# EAGLE design TinyIRCam-breakout-mk-1.0 (EAGLE 7.5.0)
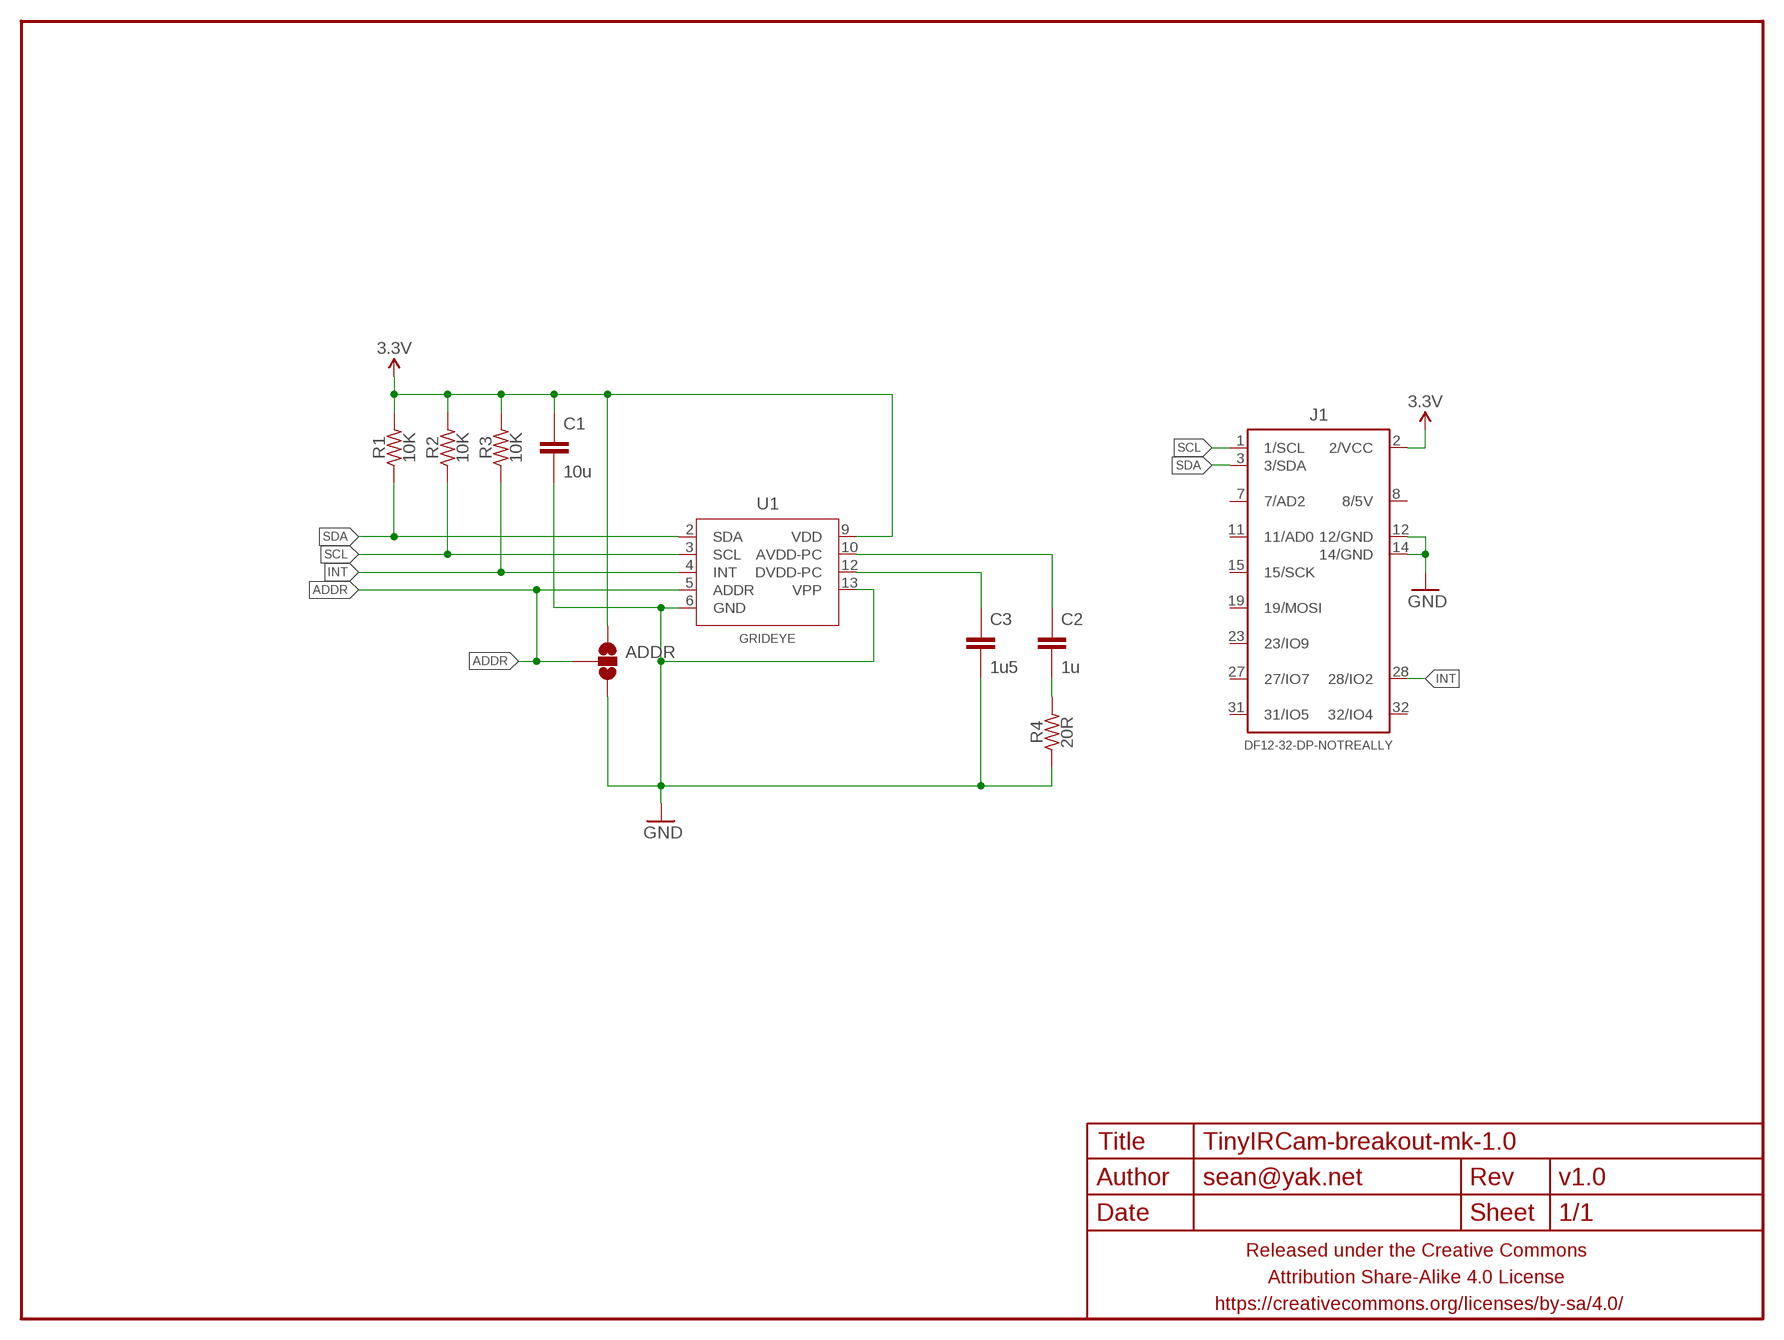
[diagram p0: schematic, sheet 1]

## Parts
ADDR  JUMPER-PAD-3-NOSMALLER  [PAD-JUMPER-3-NO_YES_SILK_FULL_BOX_SMALLER]
C1  10u  CAPACITOR-CERAMICC0603-TIGHTER  [C0603-TIGHTER]
C2  1u  CAPACITOR-CERAMICC0603-TIGHTER  [C0603-TIGHTER]
C3  1u5  CAPACITOR-CERAMICC0603-TIGHTER  [C0603-TIGHTER]
FRAME1  FRAME-LETTERNO_PACKAGE  [DUMMY]
J1  DF12-32-DP-NOTREALLY  [DF12-32-DP-I2C+EXTRA]
R1  10K  RESISTORR0603-TIGHTER  [R0603-TIGHTER]
R2  10K  RESISTORR0603-TIGHTER  [R0603-TIGHTER]
R3  10K  RESISTORR0603-TIGHTER  [R0603-TIGHTER]
R4  20R  RESISTORR0603-TIGHTER  [R0603-TIGHTER]
U1  GRIDEYE  [GRIDEYE]

## Nets
3.3V: ADDR.1 C1.1 J1.2(2/VCC) R1.2 R2.2 R3.2 U1.9(VDD)
ADDR: ADDR.2 U1.5(ADDR)
GND: ADDR.3 C1.2 C3.2 J1.12(12/GND) J1.14(14/GND) R4.1 U1.6(GND) U1.13(VPP)
INT: J1.28(28/IO2) R3.1 U1.4(INT)
N$1: C2.2 R4.2
N$2: C3.1 U1.12(DVDD-PC)
N$3: C2.1 U1.10(AVDD-PC)
SCL: J1.1(1/SCL) R2.1 U1.3(SCL)
SDA: J1.3(3/SDA) R1.1 U1.2(SDA)
Unconnected: J1.7(7/AD2) J1.8(8/5V) J1.11(11/AD0) J1.15(15/SCK) J1.19(19/MOSI) J1.23(23/IO9) J1.27(27/IO7) J1.31(31/IO5) J1.32(32/IO4)

## Library data of the parts
ADDR = a_parts:JUMPER-PAD-3-NO
C1-C3 = a_parts:CAPACITOR-CERAMIC: CAPACITOR, European symbol
FRAME1 = a_parts:FRAME-LETTER: Schematic Frame Standard 8.5x11 US Letter frame; DESIGNER: sean@yak.net; VERSION: v1.0
J1 = a_parts:DF12-32-DP-NOTREALLY
R1-R4 = a_parts:RESISTOR: RESISTOR, American symbol
U1 = a_parts:GRIDEYE

## Board
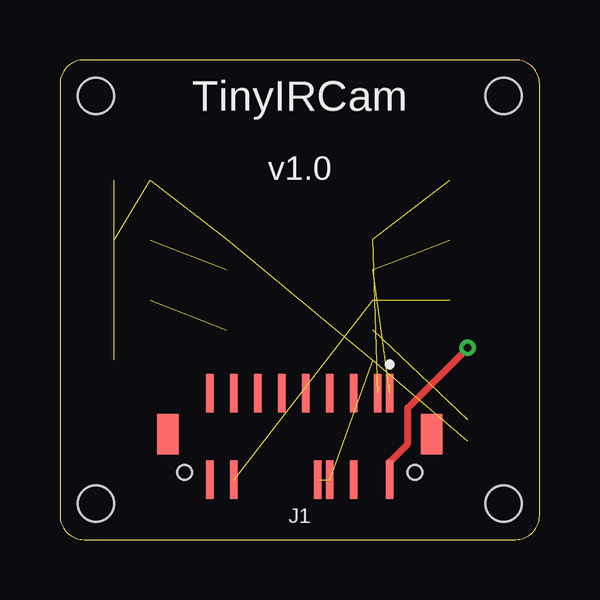
[diagram p1: board, top side]
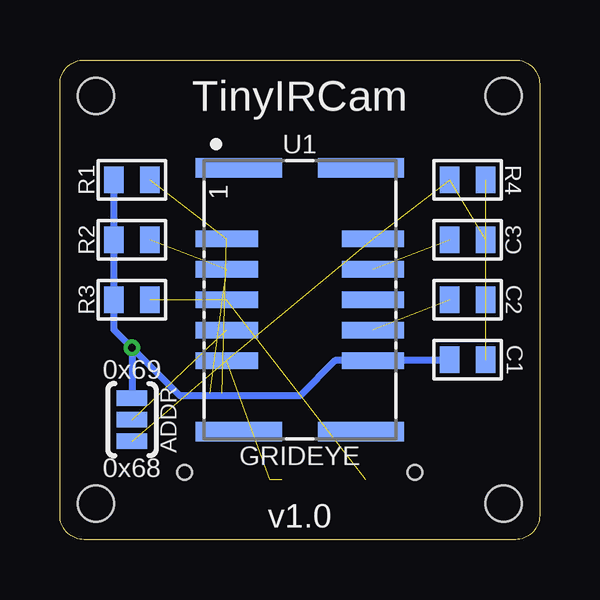
[diagram p2: board, bottom side, seen from below]

Size 20 x 20 mm. Coordinates in mm from the lower left corner, seen from the top.
Outline: 19,20 1,20 arc90 0,19 0,1 arc90 1,0 19,0 arc90 20,1 20,19 arc90 19,20
Copper layers (1*16): Top 0.0356mm / dielectric 1.5011mm / Bottom 0.0356mm
Design rules "LaenPCBOrder2": minimum track width 6mil, minimum drill 13mil, track to track 6mil, track to pad 6mil, pad to pad 6mil, via to via 6mil, smd to smd 6mil, copper to edge 15mil, drill to drill 6mil, minimum pad ring 7mil, minimum via ring 7mil, stop-mask expansion 3mil, vias tented up to drill 20mil, thermal gap 10mil
Holes 1.5 mm at 1.5,1.5 18.5,1.5 18.5,18.5 1.5,18.5

### Footprints (pad centres in the part's own frame; a part is rotated, then mirrored left to right if it is on the bottom)
PAD-JUMPER-3-NO_YES_SILK_FULL_BOX_SMALLER = smd 0.635 x 1.27: 1 -0.9,0; 2 0,0; 3 0.9,0
C0603-TIGHTER = smd 0.8 x 1.1: 1 -0.75,0; 2 0.75,0
DF12-32-DP-I2C+EXTRA = smd 0.3 x 1.6: 1 -3.75,-1.8; 2 -3.75,1.8; 3 -3.25,-1.8; 7 -2.25,-1.8; 8 -2.25,1.8; 11 -1.25,-1.8; 12 -1.25,1.8; 14 -0.75,1.8; 15 -0.25,-1.8; 19 0.75,-1.8; 23 1.75,-1.8; 27 2.75,-1.8; 28 2.75,1.8; 31 3.75,-1.8; 32 3.75,1.8 | smd 0.9 x 1.7: F1 -5.5,-0.1; F2 5.5,-0.1 | hole 0.6: -4.8,1.5; 4.8,1.5
R0603-TIGHTER = smd 0.8 x 1.1: 1 -0.75,0; 2 0.75,0
GRIDEYE = smd 0.8 x 3.6: 1 -5.5,-2.55; 7 5.5,-2.55; 8 5.5,2.55; 14 -5.5,2.55 | smd 0.7 x 2.6: 2 -2.54,-3.05; 3 -1.27,-3.05; 4 0,-3.05; 5 1.27,-3.05; 6 2.54,-3.05; 9 2.54,3.05; 10 1.27,3.05; 11 0,3.05; 12 -1.27,3.05; 13 -2.54,3.05

### Placement (x,y rotation side)
ADDR  17,5 270 bottom
C1  3,7.5 0 bottom
C2  3,10 0 bottom
C3  3,12.5 0 bottom
FRAME1  0,0 0 top
J1  10,4.3 180 top
R1  17,15 180 bottom
R2  17,12.5 180 bottom
R3  17,10 180 bottom
R4  3,15 0 bottom
U1  10,10 270 bottom

### Tracks (layer width: path | path; a pad name or v marks a point on that pad's centre or on a via)
3.3V  (via drill 0.33)
  Top 0.3: J1.2 13.75,3.25 14.5,4 14.5,5.5 v17,8
  Bottom 0.3: v17,8 ADDR.1 | v17,8 15,6 10,6 8.54,7.46 U1.9 6.91,7.5 C1.1 | v17,8 17.75,8.75 R3.2 R2.2 R1.2
ADDR  (1 unrouted)
GND  (7 unrouted)
INT  (2 unrouted)
N$1  (1 unrouted)
N$2  (1 unrouted)
N$3  (1 unrouted)
SCL  (2 unrouted)
SDA  (2 unrouted)

### Text on the board
tPlace: TinyIRCam
bPlace: TinyIRCam | 0x69 | 0x68